# EAGLE design SensorBoard_Rev3-2 (EAGLE 4.16)
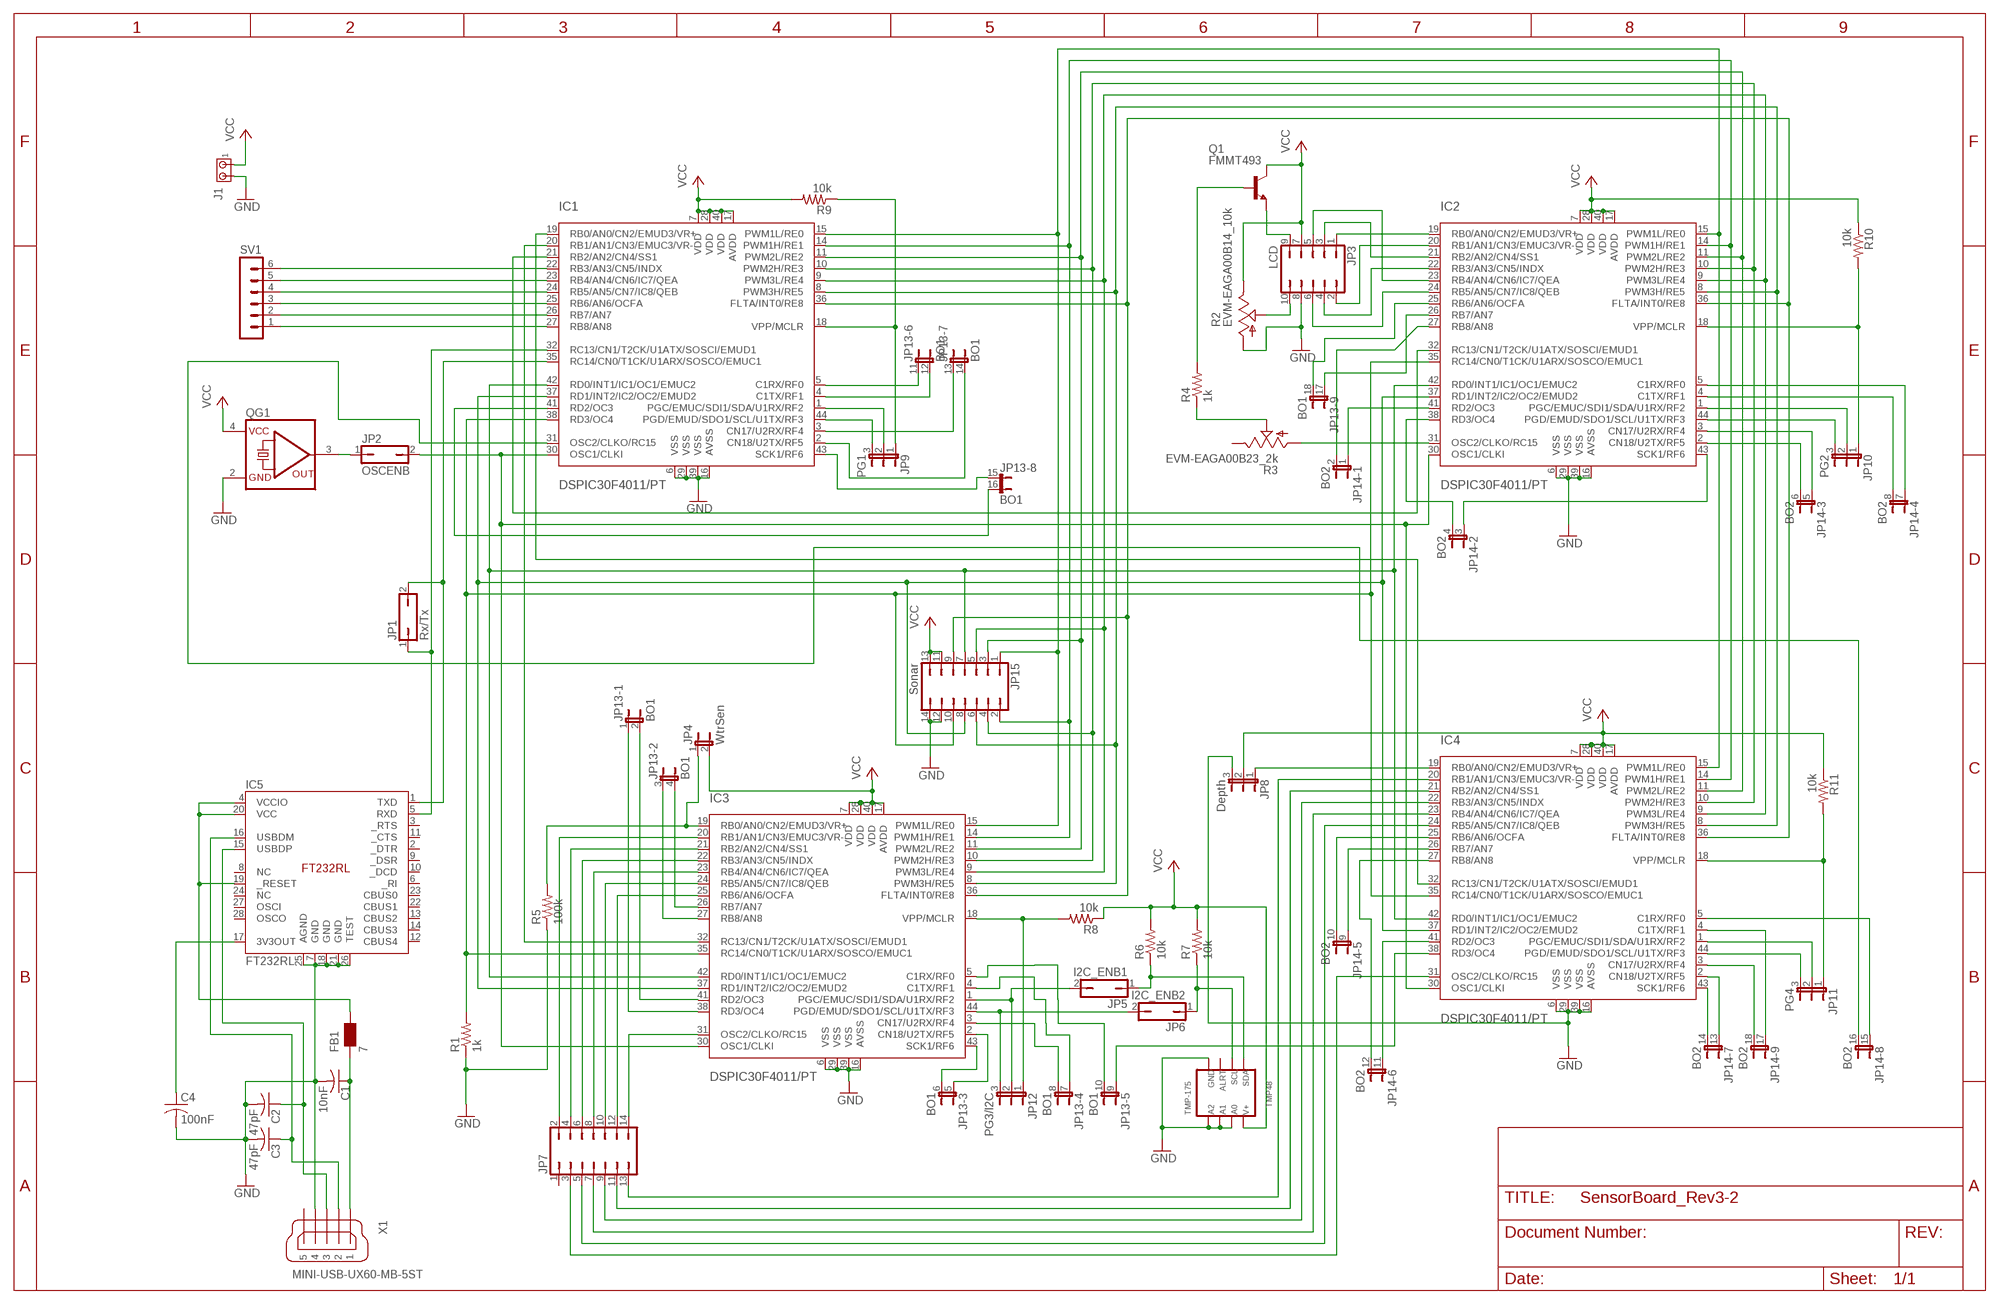
[diagram p0: schematic, sheet 1]

## Parts
C1  10nF  C-USC1206K  [C1206K]
C2  47pF  C-USC1206K  [C1206K]
C3  47pF  C-USC1206K  [C1206K]
C4  100nF  C-USC1206K  [C1206K]
FB1  7  WE-CBF_0805  [0805]
IC1  DSPIC30F4011/PT  [TQFP44]
IC2  DSPIC30F4011/PT  [TQFP44]
IC3  DSPIC30F4011/PT  [TQFP44]
IC4  DSPIC30F4011/PT  [TQFP44]
IC5  FT232RL  [SSOP-28]
J1  MTA02-156  [1X2MTA]
JP1  Rx/Tx  JP1Q  [JP1]
JP2  OSCENB  JP1Q  [JP1]
JP3  LCD  JP5Q  [JP5Q]
JP4  WtrSen  JP1E  [JP1]
JP5  I2C_ENB1  JP1Q  [JP1]
JP6  I2C_ENB2  JP1Q  [JP1]
JP7  JP7Q  [JP7Q]
JP8  Depth  JP2E  [JP2]
JP9  PG1  JP2E  [JP2]
JP10  PG2  JP2E  [JP2]
JP11  PG4  JP2E  [JP2]
JP12  PG3/I2C  JP2E  [JP2]
JP13  BO1  JP9QE  [JP9Q]
JP14  BO2  JP9QE  [JP9Q]
JP15  Sonar  JP7Q  [JP7Q]
Q1  FMMT493  -NPN-SOT23-EBC  [SOT23-EBC]
QG1  SG531  [DIL08-4]
R1  1k  R-US_R1206  [R1206]
R2  EVM-EAGA00B14_10k  TRIM_US-CT6  [CT6]
R3  EVM-EAGA00B23_2k  TRIM_US-CT6  [CT6]
R4  1k  R-US_R1206  [R1206]
R5  100k  R-US_R1206  [R1206]
R6  10k  R-US_R1206  [R1206]
R7  10k  R-US_R1206  [R1206]
R8  10k  R-US_R1206  [R1206]
R9  10k  R-US_R1206  [R1206]
R10  10k  R-US_R1206  [R1206]
R11  10k  R-US_R1206  [R1206]
SV1  MA06-1  [MA06-1]
TMP48  TMP-175  [SO-08]
X1  MINI-USB-UX60-MB-5ST  [UX60-MB-5ST]

## Nets
GND [4amps]: C1.2 C2.2 C3.2 C4.2 IC1.6(VSS) IC1.16(AVSS) IC1.29(VSS) IC1.39(VSS) IC2.6(VSS) IC2.16(AVSS) IC2.29(VSS) IC2.39(VSS) IC3.6(VSS) IC3.16(AVSS) IC3.29(VSS) IC3.39(VSS) IC4.6(VSS) IC4.16(AVSS) IC4.29(VSS) IC4.39(VSS) IC5.7(GND) IC5.18(GND) IC5.21(GND) IC5.25(AGND) IC5.26(TEST) J1.2 JP3.8 JP8.3 JP15.12 JP15.14 QG1.2(GND) R1.1 R2.A R5.1 TMP48.4 TMP48.5 TMP48.6 TMP48.7 X1.4
N$1: IC1.19(RB0/AN0/CN2/EMUD3/VR+) IC4.32(RC13/CN1/T2CK/U1ATX/SOSCI/EMUD1)
N$2: IC1.20(RB1/AN1/CN3/EMUC3/VR-) IC3.32(RC13/CN1/T2CK/U1ATX/SOSCI/EMUD1)
N$3: IC1.21(RB2/AN2/CN4/SS1) IC2.32(RC13/CN1/T2CK/U1ATX/SOSCI/EMUD1)
N$4: IC1.22(RB3/AN3/CN5/INDX) SV1.6
N$5: IC1.24(RB5/AN5/CN7/IC8/QEB) SV1.4
N$6: IC1.25(RB6/AN6/OCFA) SV1.3
N$7: IC1.26(RB7/AN7) SV1.2
N$8: IC1.27(RB8/AN8) SV1.1
N$9: IC1.30(OSC1/CLKI) IC2.30(OSC1/CLKI) IC3.30(OSC1/CLKI) IC4.30(OSC1/CLKI) JP2.2
N$10: C2.1 IC5.15(USBDP) X1.3
N$11: C1.1 FB1.1 X1.1
N$12: C3.1 IC5.16(USBDM) X1.2
N$13: C4.1 IC5.17(3V3OUT)
N$14: FB1.2 IC5.4(VCCIO) IC5.19(_RESET) IC5.20(VCC)
N$15: IC1.32(RC13/CN1/T2CK/U1ATX/SOSCI/EMUD1) IC5.5(RXD) JP1.1
N$16: IC1.35(RC14/CN0/T1CK/U1ARX/SOSCO/EMUC1) IC5.1(TXD) JP1.2
N$17: JP2.1 QG1.3(OUT)
N$18: IC1.23(RB4/AN4/CN6/IC7/QEA) SV1.5
N$19: IC1.15(PWM1L/RE0) IC2.15(PWM1L/RE0) IC3.15(PWM1L/RE0) IC4.15(PWM1L/RE0) JP15.1
N$20: IC1.14(PWM1H/RE1) IC2.14(PWM1H/RE1) IC3.14(PWM1H/RE1) IC4.14(PWM1H/RE1) JP15.2
N$21: IC1.11(PWM2L/RE2) IC2.11(PWM2L/RE2) IC3.11(PWM2L/RE2) IC4.11(PWM2L/RE2) JP15.3
N$22: IC1.10(PWM2H/RE3) IC2.10(PWM2H/RE3) IC3.10(PWM2H/RE3) IC4.10(PWM2H/RE3) JP15.4
N$23: IC1.9(PWM3L/RE4) IC2.9(PWM3L/RE4) IC3.9(PWM3L/RE4) IC4.9(PWM3L/RE4) JP15.5
N$24: IC1.8(PWM3H/RE5) IC2.8(PWM3H/RE5) IC3.8(PWM3H/RE5) IC4.8(PWM3H/RE5) JP15.6
N$25: IC1.42(RD0/INT1/IC1/OC1/EMUC2) IC2.42(RD0/INT1/IC1/OC1/EMUC2) IC3.42(RD0/INT1/IC1/OC1/EMUC2) IC4.42(RD0/INT1/IC1/OC1/EMUC2) JP15.7
N$26: IC1.37(RD1/INT2/IC2/OC2/EMUD2) IC2.37(RD1/INT2/IC2/OC2/EMUD2) IC3.37(RD1/INT2/IC2/OC2/EMUD2) IC4.37(RD1/INT2/IC2/OC2/EMUD2) JP15.8
N$27: IC1.38(RD3/OC4) IC2.35(RC14/CN0/T1CK/U1ARX/SOSCO/EMUC1) IC3.35(RC14/CN0/T1CK/U1ARX/SOSCO/EMUC1) IC4.35(RC14/CN0/T1CK/U1ARX/SOSCO/EMUC1) JP15.10 R1.2
N$28: IC1.36(FLTA/INT0/RE8) IC2.36(FLTA/INT0/RE8) IC3.36(FLTA/INT0/RE8) IC4.36(FLTA/INT0/RE8) JP15.9
N$29: IC2.19(RB0/AN0/CN2/EMUD3/VR+) JP3.1
N$30: IC2.20(RB1/AN1/CN3/EMUC3/VR-) JP3.2
N$31: IC2.21(RB2/AN2/CN4/SS1) JP3.3
N$32: IC2.22(RB3/AN3/CN5/INDX) JP3.4
N$33: IC2.23(RB4/AN4/CN6/IC7/QEA) JP3.5
N$34: IC2.24(RB5/AN5/CN7/IC8/QEB) JP3.6
N$35: JP3.10 R2.S
N$36: IC2.31(OSC2/CLKO/RC15) R3.A
N$37: R3.S R4.1
N$38: JP3.9 Q1.E
N$39: Q1.B R4.2
N$40: IC3.21(RB2/AN2/CN4/SS1) JP7.4
N$41: IC3.19(RB0/AN0/CN2/EMUD3/VR+) JP4.1 R5.2
N$42: IC3.22(RB3/AN3/CN5/INDX) JP7.6
N$43: JP6.1 R7.1 TMP48.2
N$44: JP5.1 R6.1 TMP48.1
N$45: IC3.1(PGC/EMUC/SDI1/SDA/U1RX/RF2) JP5.2 JP12.2
N$46: IC3.44(PGD/EMUD/SDO1/SCL/U1TX/RF3) JP6.2 JP12.3
N$47: IC3.23(RB4/AN4/CN6/IC7/QEA) JP7.8
N$48: IC3.24(RB5/AN5/CN7/IC8/QEB) JP7.10
N$49: IC3.25(RB6/AN6/OCFA) JP7.12
N$50: IC3.20(RB1/AN1/CN3/EMUC3/VR-) JP7.2
N$51: IC3.31(OSC2/CLKO/RC15) JP7.14
N$52: IC4.19(RB0/AN0/CN2/EMUD3/VR+) JP8.1
N$53: IC4.20(RB1/AN1/CN3/EMUC3/VR-) JP7.13
N$54: IC4.21(RB2/AN2/CN4/SS1) JP7.11
N$55: IC4.22(RB3/AN3/CN5/INDX) JP7.9
N$56: IC4.23(RB4/AN4/CN6/IC7/QEA) JP7.7
N$57: IC4.24(RB5/AN5/CN7/IC8/QEB) JP7.5
N$58: IC4.31(OSC2/CLKO/RC15) JP7.3
N$59: IC3.18(VPP/MCLR) JP12.1 R8.2
N$60: IC1.18(VPP/MCLR) JP9.1 R9.1
N$61: IC2.18(VPP/MCLR) JP10.1 R10.2
N$62: IC1.1(PGC/EMUC/SDI1/SDA/U1RX/RF2) JP9.2
N$63: IC1.44(PGD/EMUD/SDO1/SCL/U1TX/RF3) JP9.3
N$64: IC2.1(PGC/EMUC/SDI1/SDA/U1RX/RF2) JP10.2
N$65: IC2.44(PGD/EMUD/SDO1/SCL/U1TX/RF3) JP10.3
N$66: IC4.18(VPP/MCLR) JP11.1 R11.2
N$67: IC4.1(PGC/EMUC/SDI1/SDA/U1RX/RF2) JP11.2
N$68: IC4.44(PGD/EMUD/SDO1/SCL/U1TX/RF3) JP11.3
N$69: IC3.38(RD3/OC4) JP13.1
N$70: IC3.41(RD2/OC3) JP13.2
N$71: IC3.27(RB8/AN8) JP13.3
N$72: IC3.26(RB7/AN7) JP13.4
N$73: IC3.2(CN18/U2TX/RF5) JP13.5
N$74: IC3.43(SCK1/RF6) JP13.6
N$75: IC3.4(C1TX/RF1) JP13.7
N$76: IC3.3(CN17/U2RX/RF4) JP13.8
N$77: IC3.5(C1RX/RF0) JP13.10
N$78: IC1.43(SCK1/RF6) JP13.15
N$79: IC1.2(CN18/U2TX/RF5) JP13.14
N$80: IC1.3(CN17/U2RX/RF4) JP13.13
N$81: IC1.4(C1TX/RF1) JP13.12
N$82: IC1.5(C1RX/RF0) JP13.11
N$83: IC1.41(RD2/OC3) JP13.16
N$84: IC2.25(RB6/AN6/OCFA) JP13.18
N$85: IC2.26(RB7/AN7) JP13.17
N$86: IC2.27(RB8/AN8) JP14.2
N$87: IC2.41(RD2/OC3) JP14.1
N$88: IC2.38(RD3/OC4) JP14.4
N$89: IC2.43(SCK1/RF6) JP14.3
N$90: IC2.2(CN18/U2TX/RF5) JP14.6
N$91: IC2.3(CN17/U2RX/RF4) JP14.5
N$92: IC2.5(C1RX/RF0) JP14.7
N$93: IC2.4(C1TX/RF1) JP14.8
N$94: IC4.25(RB6/AN6/OCFA) JP14.10
N$95: IC4.26(RB7/AN7) JP14.9
N$96: IC4.27(RB8/AN8) JP14.12
N$97: IC4.41(RD2/OC3) JP14.11
N$98: IC4.43(SCK1/RF6) JP14.14
N$99: IC4.2(CN18/U2TX/RF5) JP14.13
N$100: IC4.3(CN17/U2RX/RF4) JP14.18
N$101: IC4.4(C1TX/RF1) JP14.17
N$102: IC4.5(C1RX/RF0) JP14.15
N$103: IC4.38(RD3/OC4) JP13.9
N$104: IC1.31(OSC2/CLKO/RC15) JP14.16
VCC [4amps]: IC1.7(VDD) IC1.17(AVDD) IC1.28(VDD) IC1.40(VDD) IC2.7(VDD) IC2.17(AVDD) IC2.28(VDD) IC2.40(VDD) IC3.7(VDD) IC3.17(AVDD) IC3.28(VDD) IC3.40(VDD) IC4.7(VDD) IC4.17(AVDD) IC4.28(VDD) IC4.40(VDD) J1.1 JP3.7 JP4.2 JP8.2 JP15.11 JP15.13 Q1.C QG1.4(VCC) R2.E R6.2 R7.2 R8.1 R9.2 R10.1 R11.1 TMP48.8
Unconnected: IC5.2(_DTR) IC5.3(_RTS) IC5.6(_RI) IC5.8(NC) IC5.9(_DSR) IC5.10(_DCD) IC5.11(_CTS) IC5.12(CBUS4) IC5.13(CBUS2) IC5.14(CBUS3) IC5.22(CBUS1) IC5.23(CBUS0) IC5.24(NC) IC5.27(OSCI) IC5.28(OSCO) JP7.1 R3.E TMP48.3 X1.5

## Library data of the parts
C1-C4 = rcl:C-US: CAPACITOR, American symbol
FB1 = wuerth-elektronik:WE-CBF: SMD EMI Suppression Ferrite Beads - excellent anti-EMI properties - low DCR - impedances till 3000 ohms - rated current up to 6 A
IC1-IC4 = microchip-dspic:DSPIC30F4011: dsPIC Motion Controller DSC
IC5 = ftdi4:FT232RL
J1 = con-amp:MTA02-156: AMP connector
JP1 JP2 JP5 JP6 = jumper:JP1Q: JUMPER
JP3 = jumper:JP5Q: JUMPER
JP4 = jumper:JP1E: JUMPER
JP7 JP15 = jumper:JP7Q: JUMPER
JP8-JP12 = jumper:JP2E: JUMPER
JP13 JP14 = jumper:JP9QE: JUMPER
Q1 = transistor:*-NPN-: NPN Transistror
QG1 = crystal:SG531: CRYSTAL RESONATOR
R1 R4-R11 = rcl:R-US_: RESISTOR, American symbol
R2 R3 = pot:TRIM_US-: POTENTIOMETER
SV1 = con-lstb:MA06-1: PIN HEADER
TMP48 = texas:TMP-175
X1 = con-hirose:MINI-USB-: MINI USB Connector Source: http://www.hirose.co.jp/cataloge_hp/e24000019.pdf

## Net classes
0 default: width 0.178 mm, drill 0.178 mm
1 2amps: width 0.178 mm, drill 0.178 mm
2 4amps: width 0.61 mm, drill 0.178 mm

## Board
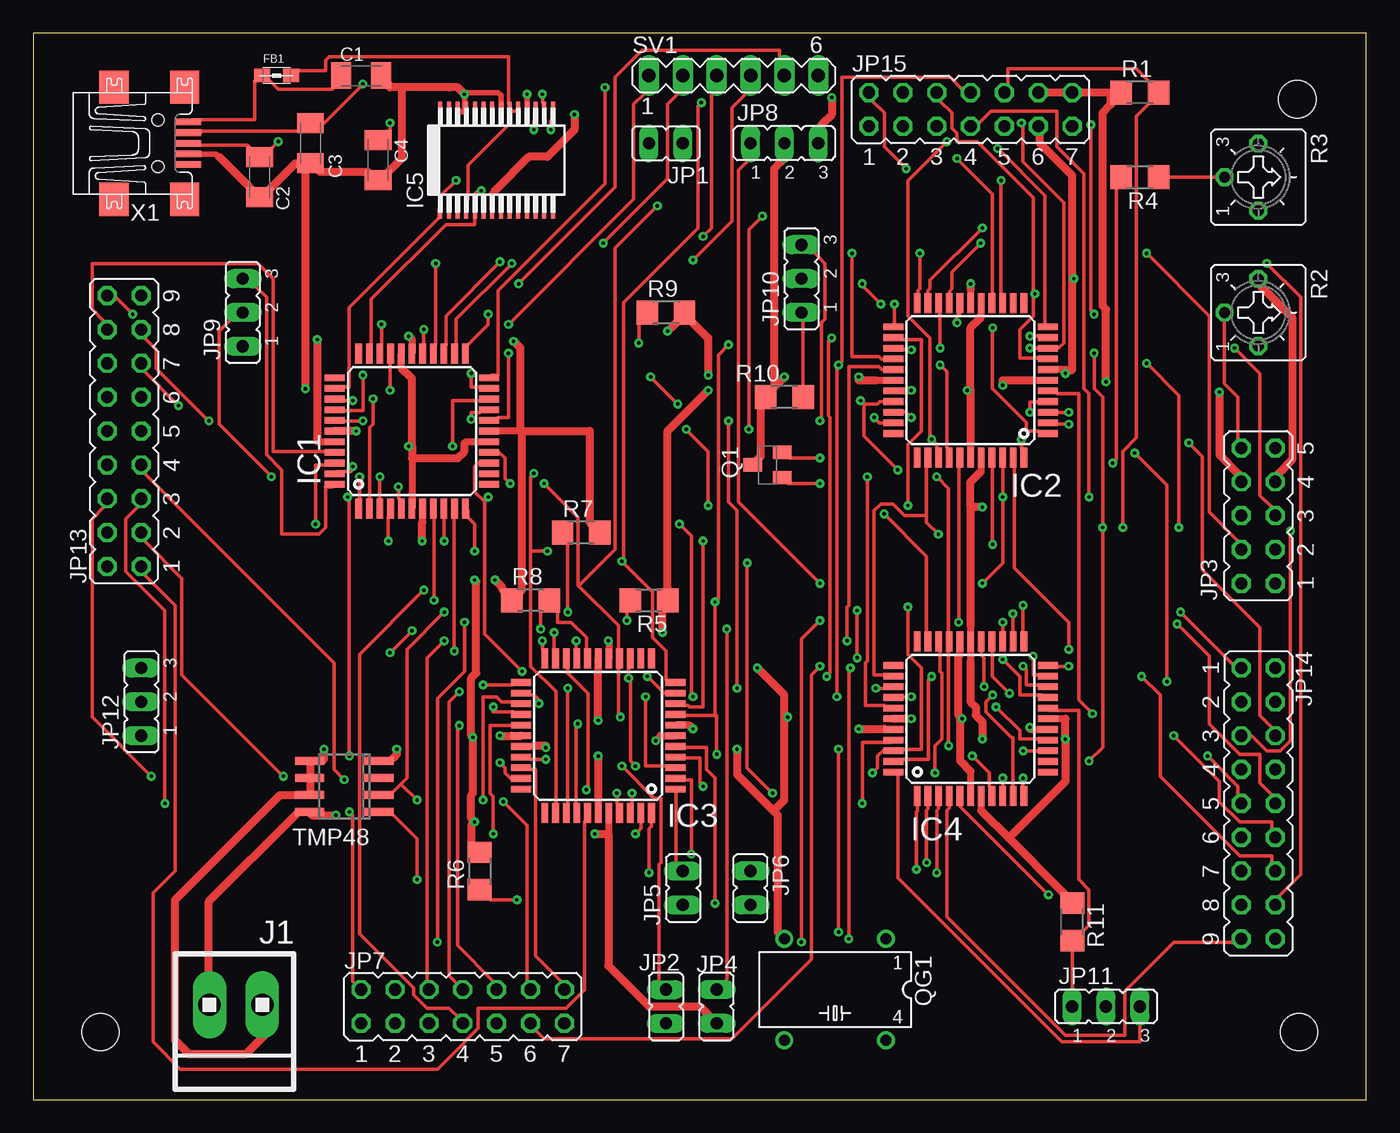
[diagram p1: board, top side]
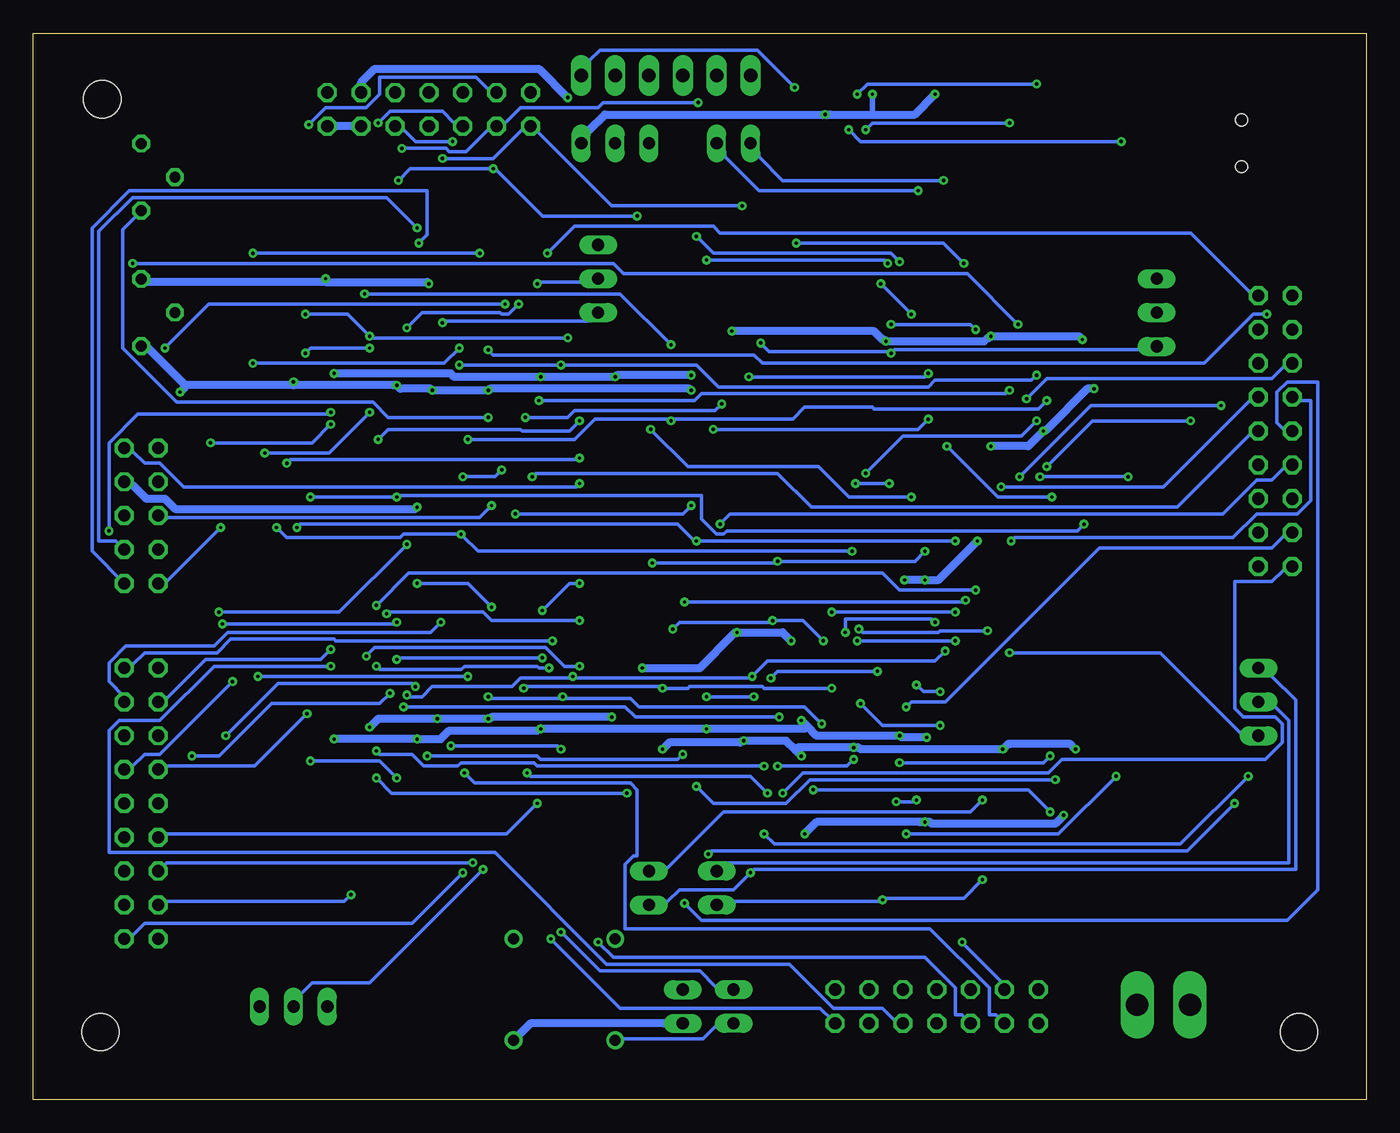
[diagram p2: board, bottom side, seen from below]

Size 100 x 80 mm. Coordinates in mm from the lower left corner, seen from the top.
Outline: 0,0 100,0 100,80 0,80 0,0
Copper layers (1*16): Top 0.1778mm / dielectric 0.7366mm / Bottom 0.1778mm
Design rules "default": minimum track width 10mil, minimum drill 10mil, track to track 8mil, track to pad 8mil, pad to pad 8mil, via to via 8mil, smd to smd 8mil, copper to edge 40mil, drill to drill 8mil, minimum pad ring 10mil, minimum via ring 8mil, stop-mask expansion 4mil, vias tented up to drill 0mil, thermal gap 10mil
Holes 2.8 mm at 5.04,5.08 94.96,5.08 94.83,75.05

### Footprints (pad centres in the part's own frame; a part is rotated, then mirrored left to right if it is on the bottom)
C1206K = smd 1.5 x 2: 1 -1.5,0; 2 1.5,0
0805 = smd 1.2 x 1: 1 -1.1,0; 2 1.1,0
TQFP44 = smd 1.5 x 0.5: 1 -5.8,4; 2 -5.8,3.2; 3 -5.8,2.4; 4 -5.8,1.6; 5 -5.8,0.8; 6 -5.8,0; 7 -5.8,-0.8; 8 -5.8,-1.6; 9 -5.8,-2.4; 10 -5.8,-3.2; 11 -5.8,-4; 23 5.8,-4; 24 5.8,-3.2; 25 5.8,-2.4; 26 5.8,-1.6; 27 5.8,-0.8; 28 5.8,0; 29 5.8,0.8; 30 5.8,1.6; 31 5.8,2.4; 32 5.8,3.2; 33 5.8,4 | smd 0.5 x 1.5: 12 -4,-5.8; 13 -3.2,-5.8; 14 -2.4,-5.8; 15 -1.6,-5.8; 16 -0.8,-5.8; 17 0,-5.8; 18 0.8,-5.8; 19 1.6,-5.8; 20 2.4,-5.8; 21 3.2,-5.8; 22 4,-5.8; 34 4,5.8; 35 3.2,5.8; 36 2.4,5.8; 37 1.6,5.8; 38 0.8,5.8; 39 0,5.8; 40 -0.8,5.8; 41 -1.6,5.8; 42 -2.4,5.8; 43 -3.2,5.8; 44 -4,5.8
SSOP-28 = smd 0.3 x 1.5: 1 -4.225,-3.625; 2 -3.575,-3.625; 3 -2.925,-3.625; 4 -2.275,-3.625; 5 -1.625,-3.625; 6 -0.975,-3.625; 7 -0.325,-3.625; 8 0.325,-3.625; 9 0.975,-3.625; 10 1.625,-3.625; 11 2.275,-3.625; 12 2.925,-3.625; 13 3.575,-3.625; 14 4.225,-3.625; 15 4.225,3.625; 16 3.575,3.625; 17 2.925,3.625; 18 2.275,3.625; 19 1.625,3.625; 20 0.975,3.625; 21 0.325,3.625; 22 -0.325,3.625; 23 -0.975,3.625; 24 -1.625,3.625; 25 -2.275,3.625; 26 -2.925,3.625; 27 -3.575,3.625; 28 -4.225,3.625
1X2MTA = drill 1.676 long: 1 1.981,0; 2 -1.981,0
JP1 = drill 0.914 long: 1 0,-1.27; 2 0,1.27
JP5Q = drill 0.914 octagon: 1 -5.08,-1.27; 2 -5.08,1.27; 3 -2.54,-1.27; 4 -2.54,1.27; 5 0,-1.27; 6 0,1.27; 7 2.54,-1.27; 8 2.54,1.27; 9 5.08,-1.27; 10 5.08,1.27
JP7Q = drill 0.914 octagon: 1 -7.62,-1.27; 2 -7.62,1.27; 3 -5.08,-1.27; 4 -5.08,1.27; 5 -2.54,-1.27; 6 -2.54,1.27; 7 0,-1.27; 8 0,1.27; 9 2.54,-1.27; 10 2.54,1.27; 11 5.08,-1.27; 12 5.08,1.27; 13 7.62,-1.27; 14 7.62,1.27
JP2 = drill 0.914 long: 1 -2.54,0; 2 0,0; 3 2.54,0
JP9Q = drill 0.914 octagon: 1 -10.16,-1.27; 2 -10.16,1.27; 3 -7.62,-1.27; 4 -7.62,1.27; 5 -5.08,-1.27; 6 -5.08,1.27; 7 -2.54,-1.27; 8 -2.54,1.27; 9 0,-1.27; 10 0,1.27; 11 2.54,-1.27; 12 2.54,1.27; 13 5.08,-1.27; 14 5.08,1.27; 15 7.62,-1.27; 16 7.62,1.27; 17 10.16,-1.27; 18 10.16,1.27
SOT23-EBC = smd 1 x 1.4: B 0.95,-1.1; C 0,1.1; E -0.95,-1.1
DIL08-4 = drill 0.813 round: 1 -3.81,-3.81; 2 3.81,-3.81; 3 3.81,3.81; 4 -3.81,3.81
R1206 = smd 1.6 x 1.8: 1 -1.4,0; 2 1.4,0
CT6 = drill 0.813 octagon: A 2.515,0; E -2.515,0; S 0,-2.54
MA06-1 = drill 1.016 long: 1 -6.35,0; 2 -3.81,0; 3 -1.27,0; 4 1.27,0; 5 3.81,0; 6 6.35,0
SO-08 = smd 0.6 x 2.2: 1 -1.905,-2.6; 2 -0.635,-2.6; 3 0.635,-2.6; 4 1.905,-2.6; 5 1.905,2.6; 6 0.635,2.6; 7 -0.635,2.6; 8 -1.905,2.6
UX60-MB-5ST = smd 2 x 0.5: 1 2.25,1.6; 2 2.25,0.8; 3 2.25,0; 4 2.25,-0.8; 5 2.25,-1.6 | smd 2.2 x 2.5: M1 -3.3,-4.2; M2 -3.3,4.2; M3 2,4.2; M4 2,-4.2 | hole 0.9: 0,-1.75; 0,1.75

### Placement (x,y rotation side)
C1  24.6,76.83 0 top
C2  16.98,69.21 270 top
C3  20.79,71.75 270 top
C4  25.87,70.48 270 top
FB1  18.25,76.83 0 top
IC1  28.41,50.16 90 top
IC2  70.32,53.97 180 top
IC3  42.38,27.3 180 top
IC4  70.32,28.57 90 top
IC5  34.76,70.48 0 top
J1  15.2,7.11 180 top
JP1  47.46,71.75 90 top
JP2  47.46,6.98 0 top
JP3  91.91,43.81 90 top
JP4  51.27,6.98 180 top
JP5  48.73,15.87 0 top
JP6  53.81,15.87 180 top
JP7  32.22,6.98 0 top
JP8  56.35,71.75 0 top
JP9  15.71,59.05 90 top
JP10  57.62,61.59 90 top
JP11  80.48,6.98 0 top
JP12  8.09,29.84 90 top
JP13  6.82,50.16 90 top
JP14  91.91,22.22 270 top
JP15  70.32,74.29 0 top
Q1  55.08,47.62 90 top
QG1  60.16,8.25 180 top
R1  83.02,75.56 0 top
R2  91.91,59.05 270 top
R3  91.91,69.21 270 top
R4  83.02,69.21 180 top
R5  46.19,37.46 180 top
R6  33.49,17.14 90 top
R7  41.11,42.54 0 top
R8  37.3,37.46 0 top
R9  47.46,59.05 0 top
R10  56.35,52.7 0 top
R11  77.94,13.33 270 top
SV1  52.54,76.83 0 top
TMP48  23.33,23.49 90 top
X1  9.36,71.75 0 top

### Tracks (layer width: path | path; a pad name or v marks a point on that pad's centre or on a via)
GND  (via drill 0.25)
  Top 0.254: 43.27,33.02 IC3.16
  Top 0.406: IC5.21 35.09,75.36 34.89,75.56 32.47,75.56 v32.35,75.43 32.35,74.16 | 32.35,74.16 32.41,74.1 | 32.41,74.1 IC5.25 32.41,74.1 | 32.35,74.16 32.41,74.1 | IC5.26 32.29,74.1 32.35,74.16 | IC5.7 34.44,68 34.63,68.19 | IC5.18 37.03,75.42 v37.05,75.43 | X1.4 13.64,70.95 13.72,70.95 13.93,70.73
  Top 0.508: 27.61,54.9 27.65,54.86 27.61,54.9 | 70.32,49.27 70.32,49.14 IC2.39 | IC2.16 71.12,58.83 71.08,58.8 | 28.41,48.13 IC1.6 | 47.08,27.3 IC3.6 | 42.38,22.47 IC3.39 | IC3.29 37.52,26.5 37.55,26.54 | IC3.16 43.18,34.37 v43.14,34.41 | 70.32,24.63 IC4.6 | 27.61,54.9 IC1.29 | IC4.29 69.52,33.36 69.43,33.27 69.43,33.14 69.39,33.14 | 74.89,53.97 75.02,53.97 IC2.6 | IC2.29 65.71,53.17 65.75,53.21 | v74.77,27.93 74.89,27.93 75.02,27.81 75.06,27.77 IC4.16 | IC1.16 32.51,49.36 32.44,49.36 32.35,49.27 32.35,49.14
  Top 0.61: v65.88,28.57 65.24,28.57 IC4.39 | 70.32,24.63 69.56,25.39 69.52,25.43 69.52,28.57 | 75.02,27.81 74.77,27.81 v74.77,27.93 | v47.21,35.05 47.21,36.57 47.21,37.08 R5.1 | v42.38,25.78 42.38,22.47 | v46.7,26.92 47.08,27.3 | 37.55,26.54 38.44,26.54 v38.44,26.41 | v27.27,26.28 27.27,25.9 27.01,25.65 26.76,25.39 26,25.39 TMP48.4 | QG1.2 55.84,12.57 55.84,21.33 55.52,21.65 | 55.52,21.65 52.79,24.38 v52.79,26.28 | v54.32,32.38 56.35,30.35 56.35,28.7 | 56.35,28.7 56.35,22.47 55.71,21.84 55.52,21.65 | 56.35,28.7 v56.6,28.7 | v21.81,26.28 21.81,25.65 21.81,25.52 21.68,25.39 20.79,25.39 | 28.41,49.02 28.41,54.1 27.65,54.86 | 28.41,49.02 28.41,48.13 28.66,48.13 31.84,48.13 32.35,48.64 32.35,49.14 | v24.22,50.16 23.33,50.16 IC1.39 | v28.16,49.02 28.41,49.02 | 27.65,75.94 26.76,75.94 26.76,76.07 26.12,76.7 26.1,76.73 C1.2 | 27.65,75.94 31.2,75.94 31.84,75.94 v32.35,75.43 | 13.93,70.73 15.58,69.08 16.98,67.69 | 27.65,75.94 27.65,75.69 27.65,70.61 26.76,69.72 26.02,68.98 C4.2 25.72,68.98 25.11,69.59 24.98,69.59 21.68,69.59 21.55,69.59 20.92,70.23 20.89,70.25 C3.2 | v20.41,53.34 20.41,69.59 20.41,69.84 20.79,70.23 C3.2 | 80.86,75.56 78.58,75.56 JP15.14 77.3,75.56 76.03,75.56 JP15.12 | 80.86,75.56 R1.1 | v59.91,75.18 59.91,73.91 59.14,73.15 59.14,72 JP8.3 | 70.32,53.21 70.32,57.91 71.08,58.67 71.08,58.8 | 70.32,53.21 70.32,49.27 | v65.88,53.21 65.75,53.21 | v70.07,53.21 70.32,53.21 | 74.89,53.97 72.73,53.97 v72.73,53.59 | v88.99,53.08 88.99,48.38 90.39,46.98 90.51,46.86 90.64,46.73 JP3.8 | v80.48,53.84 80.48,59.3 80.23,59.56 80.23,74.04 80.86,74.67 80.86,75.56 | v50.63,53.21 47.59,50.16 47.59,38.35 R5.1
  Top 0.61: 20.79,24.12 TMP48.6 | 20.79,24.12 20.79,23.11 20.79,22.86 TMP48.7 18.5,22.86 10.63,14.98 10.63,4.44 11.65,3.42 15.96,3.42 17.36,4.82 17.36,7.11 J1.2 | 20.79,25.39 TMP48.5 | 20.79,24.12 20.79,25.39 | 16.98,67.81 16.85,67.81 | 16.98,67.81 17.23,67.81 17.87,68.45 19.65,70.23 20.66,70.23 20.69,70.25 C3.2 | C2.2 16.98,67.69 | 16.98,67.81 C2.2 | C2.2 16.98,67.69 | R5.1 | 34.63,68.19 37.17,70.73 38.57,70.73 40.6,72.77 v40.6,73.91 | C2.2 16.98,67.69 | 69.52,28.57 69.52,28.73 | 69.39,33.18 69.39,33.14 69.39,28.86 | 69.52,28.57 69.56,28.57 v69.69,28.57 | v69.69,28.57 69.39,28.86 | v69.69,28.57 69.39,28.86
  Bottom 0.406: 37.05,73.91 v37.05,75.43
  Bottom 0.61: v74.77,27.93 74.13,28.57 v69.69,28.57 v65.88,28.57 65.75,28.57 65.62,28.7 v56.6,28.7 | v43.14,34.41 43.78,35.05 v47.21,35.05 47.33,35.05 47.46,34.92 50,32.38 v54.32,32.38 | 42.82,26.22 43.52,26.92 v46.7,26.92 46.82,26.92 46.95,26.79 52.29,26.79 v52.79,26.28 | 42.82,26.22 v42.38,25.78 | 42.82,26.22 42.63,26.41 v38.44,26.41 38.19,26.41 38.06,26.41 37.94,26.28 v27.27,26.28 26.89,26.66 26.76,26.66 22.19,26.66 v21.81,26.28 | v28.16,49.02 25.36,49.02 v24.22,50.16 24.09,50.16 23.96,50.29 20.92,53.34 v20.41,53.34 | v59.91,75.18 62.06,77.34 74.38,77.34 75.4,76.32 75.4,75.81 JP15.12 | 88.61,53.59 91.28,56.26 91.66,56.64 91.76,56.54 R2.A | 80.48,53.59 72.99,53.59 v72.73,53.59 72.48,53.34 70.32,53.34 70.19,53.34 v70.07,53.21 v65.88,53.21 65.75,53.34 65.62,53.34 50.76,53.34 v50.63,53.21 | 80.48,53.59 88.61,53.59 | 88.73,53.34 v88.99,53.08 88.73,53.34 | 80.48,53.59 v80.48,53.84 | v32.35,75.43 33.87,73.91 37.05,73.91 40.22,73.91 | v40.6,73.91 57.11,73.91 58.25,72.77 58.89,72.13 JP8.3 | v40.6,73.91 40.22,73.91 | v40.6,73.91 40.22,73.91 | 88.61,53.59 88.61,53.46 88.73,53.34
N$1  (via drill 0.25)
  Top 0.254: v32.85,51.05 32.85,51.56 33.49,51.56 33.62,51.68 34.12,51.68 IC1.19 | v48.98,50.29 50.63,48.64 v50.63,44.57 | v63.84,43.94 67.02,40.76 67.02,35.05 67.12,34.95 IC4.32
  Bottom 0.254: v32.85,51.05 33.62,50.29 v48.98,50.29 | v50.63,44.57 51.27,43.94 v63.84,43.94
N$2  (via drill 0.25)
  Top 0.254: v31.46,49.02 31.46,52.45 33.49,52.45 33.6,52.56 IC1.20 | v23.58,45.21 23.71,45.08 v23.71,25.78 | v35.01,25.27 35.39,24.89 35.39,24.51 35.9,24 36.54,24 36.58,24.04 IC3.32
  Bottom 0.254: v31.46,49.02 27.65,45.21 v23.58,45.21 | v23.71,25.78 24.22,25.27 v35.01,25.27
N$3  (via drill 0.25)
  Top 0.254: v32.85,54.48 32.85,53.46 33.49,53.46 33.59,53.36 IC1.21 | v46.32,54.22 v48.35,52.19 | IC2.32 63.49,50.77 v63.08,51.18
  Bottom 0.254: v32.85,54.48 33.11,54.22 v46.32,54.22 | v48.35,52.19 48.86,51.68 59.4,51.68 59.91,51.18 v63.08,51.18
N$4  (via drill 0.25)
  Top 0.254: v42.89,75.94 42.89,68.7 34.89,60.7 34.89,54.35 34.38,54.35 34.25,54.22 34.21,54.18 IC1.22
  Bottom 0.254: v42.89,75.94 45.68,78.73 57.49,78.73 58.25,77.97 58.25,77.59 58.89,76.96 SV1.6
N$5  (via drill 0.25)
  Top 0.254: v35.9,62.73 31.71,58.54 31.71,56.64 31.61,56.54 IC1.24 | v49.49,62.99 52.41,65.91 52.41,74.42 53.43,75.43 53.81,75.81 SV1.4
  Bottom 0.254: v35.9,62.73 36.16,62.99 v49.49,62.99
N$6  (via drill 0.25)
  Top 0.254: v35.01,62.86 30.95,58.8 30.95,56.64 30.81,56.5 IC1.25 | v50.25,64.77 50.89,65.4 50.89,75.43 51.27,75.81 SV1.3
  Bottom 0.254: v35.01,62.86 35.65,63.5 48.98,63.5 v50.25,64.77
N$7  (via drill 0.25)
  Top 0.254: v30.19,62.73 30.19,56.64 30.01,56.46 IC1.26 | v42.76,64.26 47.59,69.08 47.59,74.67 48.35,75.43 48.73,75.81 SV1.2
  Bottom 0.254: v30.19,62.73 31.71,64.26 v42.76,64.26
N$8  (via drill 0.25)
  Top 0.254: v29.3,57.78 29.3,56.64 29.21,56.55 IC1.27 | v35.65,58.16 45.05,67.56 45.05,74.67 45.81,75.43 46.19,75.81 SV1.1
  Bottom 0.254: v29.3,57.78 29.68,58.16 v35.65,58.16
N$9  (via drill 0.25)
  Top 0.254: v38.44,25.52 37.3,25.52 37.17,25.65 36.66,25.65 36.61,25.7 IC3.30 | v44.16,25.01 46.57,22.6 47.08,22.6 47.08,17.77 46.95,17.65 46.95,8.89 46.95,8.76 JP2.2 | 62.32,52.19 62.32,49.78 v64.86,47.24 | v67.78,46.73 68.67,45.84 68.67,35.05 68.72,35 IC4.30 68.72,33.7 68.67,33.65 v68.67,26.54 | v26.76,53.21 26.76,55.24 26.81,55.29 IC1.30 | 62.32,52.19 v62.06,52.45 62.32,52.19 | v60.41,12.57 v60.41,26.28 | IC2.30 63.51,52.37 63.34,52.19 62.32,52.19
  Bottom 0.254: v38.44,25.52 38.95,25.01 v44.16,25.01 | v64.86,47.24 65.37,46.73 v67.78,46.73 | v26.76,53.21 27.01,52.95 49.87,52.95 50.38,52.45 v62.06,52.45 | v60.41,12.57 57.49,9.65 50,9.65 48.86,8.5 47.71,8.5 JP2.2 | v60.41,26.28 60.67,26.54 v68.67,26.54
N$10  (via drill 0.25)
  Top 0.254: v38.82,72.77 38.82,73.4 38.95,73.4 38.98,73.44 IC5.15 | v18.38,71.88 17.87,71.37 17.11,70.61 17,70.71 C2.1 16.98,70.73 16.85,70.86 16.09,71.62 12.54,71.62 12.41,71.75 X1.3
  Bottom 0.254: v38.82,72.77 37.94,71.88 v18.38,71.88
N$11
  Top 0.254: C1.1 23.08,76.83 22.44,76.19 22.44,75.94 22.44,75.81 18.38,75.81 17.74,76.45 17.36,76.83 FB1.1 17.11,76.83 16.73,76.45 16.6,76.45 16.6,73.53 12.54,73.53 11.9,73.53 11.77,73.4 11.72,73.35 X1.1
N$12  (via drill 0.25)
  Top 0.254: v38.19,75.43 38.19,74.8 38.34,74.65 IC5.16 | 21.81,73.27 21.68,73.15 | 21.81,73.27 v24.73,76.19 | 12.66,72.64 12.54,72.64 | 12.66,72.64 19.9,72.64 20.15,72.64 20.66,73.15 20.77,73.25 C3.1 21.78,73.25 21.81,73.27 | X1.2 12.57,72.55 12.66,72.64
  Bottom 0.254: v38.19,75.43 37.43,76.19 v24.73,76.19
N$13  (via drill 0.25)
  Top 0.254: v37.55,72.77 37.55,73.4 37.69,73.53 IC5.17 | v26.76,73.27 26.76,72.64 26.5,72.64 25.87,72 C4.1
  Bottom 0.254: v37.55,72.77 37.05,73.27 v26.76,73.27
N$14
  Top 0.254: 35.78,74.16 36.28,74.16 36.41,74.16 36.38,74.14 IC5.19 | IC5.4 32.48,66.81 32.47,66.8 32.47,67.43 32.6,67.56 32.6,70.1 35.65,73.15 35.65,73.4 35.78,73.53 35.78,74.16 | 35.78,74.16 35.73,74.12 | 35.73,74.12 IC5.20 35.73,74.12 | 35.78,74.16 35.78,74.67 35.65,74.8 35.65,78.23 22.19,78.23 21.93,77.97 21.93,77.21 19.9,77.21 19.65,77.21 19.27,76.83 FB1.2 | 35.78,74.16 35.73,74.12
N$15  (via drill 0.25)
  Top 0.254: IC1.32 25.21,56.48 25.36,56.64 25.36,60.07 30.95,65.65 33.11,65.65 33.11,66.16 33.11,66.8 | 33.11,66.8 33.13,66.82 | 33.13,66.82 IC5.5 33.13,66.82 | v33.62,68.19 33.36,68.19 33.11,67.94 33.11,66.8 | 33.11,66.8 33.13,66.82
  Bottom 0.254: v33.62,68.19 45.55,68.19 48.09,70.73 48.09,71.11 JP1.1
N$16  (via drill 0.25)
  Top 0.254: v31.71,68.96 30.57,67.81 30.57,67.56 30.57,66.92 | 30.57,66.92 30.54,66.89 | 30.54,66.89 IC5.1 30.54,66.89 | 30.57,66.92 30.44,66.8 30.44,66.16 23.71,59.43 23.71,53.46 23.33,53.46 22.7,53.46 22.57,53.34 22.59,53.36 IC1.35 | 30.57,66.92 30.54,66.89
  Bottom 0.254: v31.71,68.96 43.78,68.96 45.55,70.73 45.55,70.99 46.32,71.75 JP1.2
N$17
  Bottom 0.254: QG1.3 56.22,4.57 55.71,4.57 49.75,4.57 48.86,5.46 47.84,5.46 47.59,5.71 JP2.1
N$18  (via drill 0.25)
  Top 0.254: v34.12,58.92 34.12,58.16 32.6,56.64 32.41,56.45 IC1.23 | v36.41,61.21 43.65,68.45 43.65,76.7 45.68,78.73 55.97,78.73 55.97,78.23 55.97,77.08 56.35,76.7 SV1.5
  Bottom 0.254: v34.12,58.92 v36.41,61.21
N$19  (via drill 0.25)
  Top 0.254: v69.3,70.61 71.97,67.94 71.97,60.45 71.97,59.81 IC2.15 | 40.92,38.54 40.86,38.6 40.86,43.68 v38.32,46.22 | 40.92,38.54 43.9,35.55 43.9,33.78 43.9,33.4 44.03,33.27 43.98,33.22 IC3.15 43.98,33.07 44.03,33.02 43.9,32.89 43.9,32.38 43.9,28.82 v44.03,28.7 | v35.78,46.22 35.39,46.6 35.39,48.13 34.89,48.64 34.25,48.64 34.21,48.59 IC1.15 | v72.22,29.46 74,27.68 74,27.05 75.4,27.05 75.91,27.05 76.03,26.92 76.09,26.97 IC4.15 | v46.82,67.05 43.65,63.88 43.65,41.27 40.98,38.6 40.92,38.54
  Bottom 0.254: v69.3,70.61 65.49,70.61 63.34,72.77 63.08,73.02 JP15.1 62.32,72.64 62.19,72.64 56.6,67.05 v46.82,67.05 | v38.32,46.22 v35.78,46.22 | v72.22,29.46 55.59,29.46 54.83,28.7 44.28,28.7 v44.03,28.7
N$20  (via drill 0.25)
  Top 0.254: v72.61,68.96 72.61,60.45 72.61,60.07 72.73,59.94 72.72,59.93 IC2.14 | v65.49,69.84 63.84,71.5 63.84,74.04 62.95,74.92 62.95,75.31 JP15.2 | v36.66,32.13 33.87,34.92 33.87,44.83 33.81,44.89 | 33.81,44.89 33.11,45.59 33.11,47.49 33.36,47.75 33.38,47.76 IC1.14 | v74.26,26.16 75.4,26.16 76.03,26.16 76.05,26.17 IC4.14 | v45.17,25.01 44.79,25.39 44.79,31.49 v44.67,31.62 44.67,32.38 44.67,32.51 44.78,32.62 IC3.14 | v54.7,66.29 53.68,65.27 v53.68,50.29 | v34.12,45.21 33.87,44.95 33.81,44.89
  Bottom 0.254: v72.61,68.96 71.72,69.84 v65.49,69.84 65.37,69.84 65.24,69.72 61.81,66.29 v54.7,66.29 | v44.67,31.62 44.16,32.13 v36.66,32.13 | v74.26,26.16 74,25.9 71.59,25.9 70.7,25.01 68.16,25.01 67.91,25.27 62.45,25.27 62.19,25.01 v45.17,25.01 | v53.68,50.29 50.89,47.49 41.11,47.49 38.82,45.21 v34.12,45.21
N$21  (via drill 0.25)
  Top 0.254: v72.35,71.37 75.91,67.81 75.91,58.16 76.16,57.91 76.12,57.95 IC2.11 | v33.11,41.14 33.11,43.18 32.6,43.68 32.6,44.19 32.47,44.32 32.43,44.36 IC1.11 | v74.26,24.12 74.26,23.49 74.26,22.86 74.38,22.73 74.34,22.77 IC4.11 | v55.46,22.98 53.56,24.89 v53.56,40.25 | v50.13,74.8 49.87,74.54 49.87,65.4 44.28,59.81 44.28,40.64 44.16,40.51 v44.16,40.38 46.44,38.1 46.44,34.67 47.46,33.65 47.46,31.49 47.65,31.3 IC3.11
  Bottom 0.254: v72.35,71.37 69.05,71.37 68.8,71.11 67.53,71.11 65.88,72.77 65.49,72.77 JP15.3 64.99,73.27 64.61,73.27 63.46,74.42 57.62,74.42 57.24,74.8 v50.13,74.8 | v33.11,41.14 33.87,40.38 v44.16,40.38 44.28,40.38 44.41,40.25 v53.56,40.25 | v74.26,24.12 73.11,22.98 v55.46,22.98
N$22  (via drill 0.25)
  Top 0.254: v74.77,57.27 75.4,57.27 75.91,57.27 76.03,57.15 76.06,57.17 IC2.10 | v79.59,58.92 79.34,59.18 v79.34,73.15 | v31.58,33.65 31.58,43.68 31.58,44.32 31.61,44.34 IC1.10 | v46.06,31.74 47.21,30.6 | 47.21,30.6 47.33,30.47 | v71.97,30.35 71.46,29.84 71.46,29.08 73.37,27.17 73.5,27.17 73.5,23.49 73.52,23.46 IC4.10 | v59.91,57.15 59.65,56.89 59.65,51.3 59.78,51.18 59.78,32 v59.52,31.74 | IC3.10 47.31,30.5 47.21,30.6
  Bottom 0.254: v79.59,58.92 76.42,58.92 v74.77,57.27 74.64,57.27 74.51,57.15 v59.91,57.15 | v79.34,73.15 78.07,74.42 75.02,74.42 74,75.43 74,76.7 66.76,76.7 65.88,75.81 65.49,75.81 JP15.4 | v31.58,33.65 32.35,32.89 44.92,32.89 v46.06,31.74 46.19,31.62 46.32,31.62 59.52,31.62 | v71.97,30.35 71.84,30.22 70.83,30.22 70.07,30.98 69.69,30.98 64.1,30.98 63.46,31.62 59.52,31.62 | 59.52,31.62 v59.52,31.74
N$23  (via drill 0.25)
  Top 0.254: v50.25,41.91 50.25,29.46 49.24,29.46 49.11,29.59 48.86,29.59 48.35,29.59 48.22,29.71 48.21,29.7 IC3.9 | v30.82,41.91 30.82,43.68 30.82,44.32 30.81,44.33 IC1.9 | v72.73,24.12 72.73,23.49 72.72,23.48 IC4.9 | v79.21,25.39 80.23,26.41 v80.23,42.92 80.23,52.7 79.59,53.34 v79.59,56 | v74.77,56.38 75.4,56.38 76.03,56.38 | v74.13,73.27 74.26,73.15 74.26,70.35 77.3,67.3 77.3,56.76 76.92,56.38 76.03,56.38 | 76.03,56.38 76.05,56.37 | 76.05,56.37 IC2.9 76.05,56.37 | 76.03,56.38 76.05,56.37
  Bottom 0.254: v30.82,41.91 v50.25,41.91 50.38,41.91 50.51,42.03 51.65,43.18 79.97,43.18 v80.23,42.92 | v72.73,24.12 74,25.39 v79.21,25.39 | v79.59,56 79.21,56.38 v74.77,56.38 | v74.13,73.27 73.24,74.16 69.3,74.16 68.41,73.27 68.03,73.27 JP15.5
N$24  (via drill 0.25)
  Top 0.254: 75.02,60.45 75.02,67.69 70.83,71.88 69.3,71.88 69.3,72.51 68.92,72.89 68.92,74.04 68.03,74.92 68.03,75.31 JP15.6 | 75.02,60.45 75.02,58.8 74,57.78 74,55.62 75.4,55.62 75.91,55.62 76.03,55.49 IC2.8 | 51.14,28.82 51.27,28.82 v51.27,25.9 | 51.14,28.82 48.86,28.82 48.22,28.82 48.09,28.95 48.15,28.9 IC3.8 | v70.45,25.78 71.72,24.51 71.72,23.49 71.92,23.29 IC4.8 | v30.06,37.46 30.06,43.68 30.06,44.19 30.01,44.24 IC1.8 | 51.14,28.82 v51.14,37.33 51.4,37.59 51.4,55.88 v52.16,56.64 | v75.15,60.45 75.02,60.45
  Bottom 0.254: v51.27,25.9 51.65,25.52 61.94,25.52 62.19,25.78 v70.45,25.78 | v30.06,37.46 30.19,37.33 v51.14,37.33 | v75.15,60.45 55.97,60.45 v52.16,56.64
N$25  (via drill 0.25)
  Top 0.254: v44.92,22.98 44.92,22.22 44.78,22.08 IC3.42 | v62.95,24.51 63.34,24.89 63.34,25.78 63.84,26.28 64.35,26.28 64.48,26.16 64.49,26.17 IC4.42 65.13,26.17 65.24,26.28 66.64,26.28 66.64,32.38 65.62,33.4 v65.62,36.95 | v21.17,43.18 21.17,47.62 21.93,47.62 22.57,47.62 22.7,47.75 22.68,47.76 IC1.42 | v79.21,45.21 79.21,52.95 78.83,53.34 78.83,69.46 76.8,71.5 76.8,74.16 71.84,74.16 70.95,73.27 70.7,73.02 JP15.7 | v71.21,38.73 72.73,40.25 72.73,44.95 v72.73,45.21 72.73,47.49 72.72,47.51 IC2.42
  Bottom 0.254: v44.92,22.98 46.19,24.25 62.7,24.25 v62.95,24.51 | v21.17,43.18 21.68,42.67 47.97,42.67 48.22,42.41 48.73,42.41 49.87,43.56 49.87,45.33 72.61,45.33 v72.73,45.21 72.99,45.21 v79.21,45.21 | v65.62,36.95 67.4,38.73 v71.21,38.73
N$26  (via drill 0.25)
  Top 0.254: v40.86,28.19 40.73,28.06 40.73,22.22 40.73,21.58 40.78,21.53 IC3.37 | v65.88,30.22 65.24,30.22 64.48,30.22 IC4.37 | v24.73,54.35 24.73,51.68 23.33,51.68 22.82,51.68 22.7,51.81 22.64,51.76 IC1.37 | v68.03,55.11 68.54,54.61 68.54,48.89 68.72,48.71 IC2.37 | v60.29,30.22 60.29,54.86 60.41,54.99 v60.41,55.11 60.67,55.37 60.67,76.7 68.8,76.7 69.69,75.81 70.07,75.81 JP15.8
  Bottom 0.254: v40.86,28.19 42.13,29.46 54.57,29.46 55.21,30.09 60.29,30.09 | 60.29,30.09 65.75,30.09 v65.88,30.22 | v24.73,54.35 25.11,53.97 32.35,53.97 32.85,53.46 48.6,53.46 50.25,55.11 v60.41,55.11 v68.03,55.11 | 60.29,30.09 v60.29,30.22
N$27  (via drill 0.25)
  Top 0.254: 37.3,41.14 37.3,46.73 v37.55,46.98 | 37.3,41.14 37.3,32.51 39.2,30.6 39.2,22.22 39.2,21.58 39.18,21.56 IC3.35 | v24.73,50.92 23.33,50.92 22.7,50.92 22.66,50.96 IC1.38 | 67.02,43.81 65.37,43.81 64.86,44.32 64.48,44.7 63.59,44.7 63.08,44.19 63.08,31.87 63.84,31.87 63.95,31.77 IC4.35 | 67.02,43.81 67.02,47.49 67.02,48 67.14,48.13 67.12,48.15 IC2.35 | v81.75,42.92 81.75,48.64 82.77,49.65 82.77,73.78 83.66,74.67 84.42,75.43 84.42,75.44 R1.2 84.42,75.69 83.66,76.45 82.77,77.34 73.11,77.34 73.11,76.19 73.11,75.81 JP15.10 | v67.91,42.41 67.02,43.3 67.02,43.81 | 37.3,41.14 v38.57,41.14
  Bottom 0.254: v37.55,46.98 34.76,49.78 25.87,49.78 v24.73,50.92 | v81.75,42.92 80.99,42.16 72.48,42.16 72.22,42.41 v67.91,42.41 67.78,42.29 66.64,41.14 v38.57,41.14
N$28  (via drill 0.25)
  Top 0.254: v40.09,30.86 40.09,22.22 40.09,21.84 39.97,21.71 39.98,21.7 IC3.36 | v63.21,30.86 63.84,30.86 63.96,30.97 IC4.36 | v23.96,52.45 23.33,52.45 22.82,52.45 22.7,52.57 22.68,52.56 IC1.36 | v68.54,71.88 65.62,68.96 65.62,58.8 67.27,57.15 67.27,49.78 67.27,49.65 v67.4,49.53 67.78,49.14 67.78,48.89 67.78,48.26 67.91,48.13 67.92,48.14 IC2.36 | v52.79,30.86 52.79,44.19 52.16,44.83 v52.16,50.92
  Bottom 0.254: v40.09,30.86 45.17,30.86 45.3,30.98 50.76,30.98 50.89,30.86 v52.79,30.86 52.92,30.98 63.08,30.98 v63.21,30.86 | v23.96,52.45 24.6,51.81 36.92,51.81 37.05,51.94 42.13,51.94 43.02,51.05 52.16,51.05 | 52.16,51.05 57.87,51.05 59.4,49.53 v67.4,49.53 | v68.54,71.88 71.34,71.88 72.22,72.77 72.61,72.77 JP15.9 | v52.16,50.92 52.16,51.05
N$29  (via drill 0.25)
  Top 0.254: v71.08,64.26 68.92,62.1 68.92,60.83 68.72,60.62 IC2.19
  Bottom 0.254: v71.08,64.26 70.45,64.89 70.45,68.19 92.8,68.19 95.59,65.4 95.59,41.14 JP3.1
N$30  (via drill 0.25)
  Top 0.254: v68.03,56.38 68.03,59.05 67.92,59.16 IC2.20 | v83.53,55.24 85.94,52.83 v85.94,42.92
  Bottom 0.254: v68.03,56.38 69.18,55.24 v83.53,55.24 | v85.94,42.92 89.88,38.98 90,38.86 90.13,38.73 JP3.2
N$31  (via drill 0.25)
  Top 0.254: v71.21,65.4 67.27,61.46 67.27,60.83 67.12,60.68 IC2.21
  Bottom 0.254: v71.21,65.4 73.5,67.69 92.55,67.69 95.08,65.15 95.08,41.91 93.81,41.91 JP3.3
N$32  (via drill 0.25)
  Top 0.254: v66.51,63.5 66.51,60.83 66.38,60.7 66.38,59.81 66.34,59.77 IC2.22 | v83.53,63.5 88.23,58.8 88.23,44.06 90.39,41.91 90.64,41.65 JP3.4
  Bottom 0.254: v66.51,63.5 v83.53,63.5
N$33  (via drill 0.25)
  Top 0.254: v64.61,59.69 64.61,58.16 64.48,58.03 64.52,57.99 IC2.23 | v90.13,56.38 92.04,54.48 92.04,45.33 92.93,44.45 93.18,44.19 JP3.5
  Bottom 0.254: v64.61,59.69 86.83,59.69 v90.13,56.38
N$34  (via drill 0.25)
  Top 0.254: v65.62,44.57 65.62,49.14 66.64,50.16 66.64,57.02 65.24,57.02 65.09,57.17 IC2.24
  Bottom 0.254: v65.62,44.57 66.51,43.68 90,43.68 90.51,43.68 JP3.6
N$35
  Top 0.254: R2.S 89.37,58.41 89.37,53.72 90.39,52.7 90.39,49.53 90.64,49.27 JP3.10
N$36  (via drill 0.25)
  Top 0.254: IC2.31 65.48,51.57 v65.88,51.18
  Bottom 0.254: v65.88,51.18 73.37,51.18 74.51,52.32 89.24,52.32 93.31,56.38 93.31,65.27 91.91,66.67 R3.A
N$37
  Top 0.254: R4.1 85.18,69.21 88.73,69.21 R3.S
N$38  (via drill 0.25)
  Top 0.254: v59.02,46.22 56.86,46.22 56.6,46.22 56.22,46.6 56.18,46.65 Q1.E
  Bottom 0.254: v59.02,46.22 59.27,45.97 88.73,45.97 90.51,47.75 91.66,47.75 92.55,48.64 92.8,48.89 JP3.9
N$39  (via drill 0.25)
  Top 0.254: v59.02,48.13 56.86,48.13 56.73,48.13 56.22,48.64 56.18,48.59 Q1.B | v80.99,47.75 81.24,48 81.24,68.32 81.24,68.83 R4.2
  Bottom 0.254: v59.02,48.13 59.14,48 80.73,48 v80.99,47.75
N$40  (via drill 0.25)
  Top 0.254: v39.08,35.05 39.08,33.78 39.08,33.27 39.18,33.17 IC3.21 | v32.35,35.81 32.35,32.13 30.31,30.09 v30.31,11.81
  Bottom 0.254: v39.08,35.05 39.08,36.06 32.6,36.06 v32.35,35.81 | v30.31,11.81 27.39,8.89 27.39,8.5 27.27,8.38 JP7.4
N$41  (via drill 0.25)
  Top 0.254: v40.73,34.41 40.73,33.78 40.73,33.27 40.86,33.14 40.81,33.1 IC3.19 | v44.54,35.94 44.54,36.57 44.54,37.08 44.79,37.33 44.79,37.34 R5.2 | v52.03,35.3 52.03,9.01 51.91,8.89 JP4.1
  Bottom 0.254: v40.73,34.41 42.25,35.94 v44.54,35.94 44.67,35.81 44.79,35.81 51.52,35.81 v52.03,35.3
N$42  (via drill 0.25)
  Top 0.254: v38.19,34.41 38.19,33.78 38.32,33.65 38.32,33.14 38.36,33.1 IC3.22 | v30.82,34.41 29.55,33.14 29.55,8.89 29.55,8.38 JP7.6
  Bottom 0.254: v30.82,34.41 v38.19,34.41
N$43  (via drill 0.25)
  Top 0.254: v40.09,36.57 40.09,41.65 40.09,42.16 R7.1 | v30.82,36.57 28.03,33.78 28.03,24.12 27.58,23.68 | 27.58,23.68 27.01,23.11 26.76,22.86 TMP48.2 | v28.79,22.47 27.65,23.62 27.58,23.68 | v53.94,17.14 JP6.1
  Bottom 0.254: v30.82,36.57 v40.09,36.57 | v28.79,22.47 29.68,21.58 48.22,21.58 52.41,17.39 53.68,17.39 v53.94,17.14
N$44  (via drill 0.25)
  Top 0.254: v36.28,14.98 34.38,14.98 34.25,14.98 R6.1 | v28.79,16.5 28.79,19.55 27.01,21.33 26.76,21.58 TMP48.1
  Bottom 0.254: v28.79,16.5 30.19,15.11 36.03,15.11 36.16,15.11 v36.28,14.98 36.41,14.85 47.33,14.85 48.6,14.85 48.86,14.6 JP5.1
N$45
  Top 0.254: IC3.1 48.18,23.28 48.22,23.24 48.22,23.11 48.22,17.77 48.22,17.65 JP5.2
  Bottom 0.254: JP5.2 48.09,17.77 47.71,17.77 5.8,17.77 5.8,28.44 6.82,29.46 7.2,29.84 JP12.2
N$46  (via drill 0.25)
  Top 0.254: v46.19,17.01 46.19,20.31 46.32,20.44 46.38,20.5 IC3.44 | v53.68,14.6 JP6.2
  Bottom 0.254: v53.68,14.6 53.43,14.85 52.41,14.85 51.52,15.74 47.46,15.74 v46.19,17.01 45.94,17.27 5.3,17.27 5.3,29.97 7.07,31.74 7.71,32.38 JP12.3
N$47  (via drill 0.25)
  Top 0.254: v33.74,31.11 35.9,31.11 36.09,31.3 IC3.23 | v31.97,30.6 31.2,29.84 31.2,9.27 31.97,8.5 JP7.8
  Bottom 0.254: v33.74,31.11 33.24,30.6 v31.97,30.6
N$48  (via drill 0.25)
  Top 0.254: v37.94,29.71 37.94,29.97 37.55,30.35 37.3,30.35 37.17,30.47 36.54,30.47 36.56,30.5 IC3.24 | v31.97,28.06 31.84,27.93 31.84,11.55 34.51,8.89 34.76,8.63 JP7.10
  Bottom 0.254: v37.94,29.71 36.28,28.06 v31.97,28.06
N$49  (via drill 0.25)
  Top 0.254: v33.74,22.47 33.74,30.22 34.76,30.22 35.14,29.84 35.9,29.84 36.04,29.7 IC3.25 | v35.27,22.35 37.05,20.57 37.05,8.89 37.3,8.63 JP7.12
  Bottom 0.254: v35.27,22.35 34,22.35 33.87,22.35 v33.74,22.47
N$50  (via drill 0.25)
  Top 0.254: v41.49,23.24 41.62,23.36 41.62,30.47 40.09,32 40.09,32.38 40.09,32.89 39.97,33.02 39.98,33.03 IC3.20 | v23.71,21.58 23.96,21.33 23.96,8.89 24.35,8.5 JP7.2
  Bottom 0.254: v41.49,23.24 25.36,23.24 v23.71,21.58
N$51
  Top 0.254: IC3.31 36.65,24.9 36.66,24.89 37.17,24.89 37.3,24.76 37.68,24.76 37.68,10.79 39.59,8.89 39.84,8.63 JP7.14
N$52  (via drill 0.25)
  Top 0.254: v72.73,33.02 74,31.74 74,30.35 75.4,30.35 75.65,30.35 75.91,30.09 75.98,30.17 IC4.19 | v61.81,33.14 v61.81,36.7 | v59.02,38.73 52.92,44.83 52.92,69.72 53.56,70.35 53.56,71.37 53.81,71.62 JP8.1
  Bottom 0.254: v72.73,33.02 72.61,33.14 v61.81,33.14 | v61.81,36.7 59.78,38.73 v59.02,38.73
N$53  (via drill 0.25)
  Top 0.254: v74.26,32.51 74.51,32.25 74.51,31.11 75.4,31.11 75.78,31.11 75.91,30.98 75.92,30.97 IC4.20 | v61.3,32.38 61.18,32.25 v61.18,12.06
  Bottom 0.254: v74.26,32.51 74,32.25 67.91,32.25 67.65,32.51 62.19,32.51 62.06,32.38 v61.3,32.38 | v61.18,12.06 55.97,6.85 40.98,6.85 40.09,5.96 JP7.13
N$54  (via drill 0.25)
  Top 0.254: v75.02,33.27 75.02,31.87 75.4,31.87 75.91,31.87 76.03,31.74 76.06,31.77 IC4.21 | v59.02,32.51 58.38,31.87 58.38,10.54 52.41,4.57 38.32,4.57 37.68,5.2 37.55,5.33 37.3,5.58 JP7.11
  Bottom 0.254: v75.02,33.27 74.38,33.9 61.56,33.9 60.16,32.51 v59.02,32.51
N$55  (via drill 0.25)
  Top 0.254: v77.69,32.51 76.8,32.51 76.16,32.51 76.12,32.55 IC4.22
  Bottom 0.254: v77.69,32.51 86.45,32.51 90.51,28.44 93.56,28.44 94.32,27.68 94.32,18.54 65.37,18.54 56.98,10.16 43.27,10.16 39.97,6.85 36.28,6.85 35.27,5.84 35.01,5.84 34.89,5.71 JP7.9
N$56  (via drill 0.25)
  Top 0.254: v74.26,37.08 74.26,35.05 74.26,34.41 74.3,34.37 IC4.23 | v29.3,38.22 24.47,33.4 24.47,12.44 28.54,8.38 28.54,7.87 29.55,6.85 31.2,6.85 32.09,5.96 32.22,5.84 JP7.7
  Bottom 0.254: v74.26,37.08 71.84,39.49 36.28,39.49 35.01,38.22 v29.3,38.22
N$57  (via drill 0.25)
  Top 0.254: v73.5,36.44 73.5,35.05 73.5,34.41 73.52,34.39 IC4.24 | v59.02,35.94 57.62,34.54 v57.62,11.81
  Bottom 0.254: v73.5,36.44 73.37,36.57 66.26,36.57 65.62,35.94 v59.02,35.94 | v57.62,11.81 56.48,10.66 33.11,10.66 30.82,8.38 30.82,6.34 30.31,6.34 29.93,5.96 JP7.5
N$58  (via drill 0.25)
  Top 0.254: v67.65,24.51 67.65,26.54 68.16,27.05 68.16,32 68.03,32.13 68.03,33.65 67.91,33.78 67.91,34.29 67.92,34.3 IC4.31
  Bottom 0.254: v67.65,24.51 66.89,23.74 55.21,23.74 54.7,23.24 54.7,18.28 54.95,18.28 55.59,17.65 55.59,12.82 32.73,12.82 28.28,8.38 28.28,6.34 27.77,6.34 27.39,5.96 JP7.3
N$59  (via drill 0.25)
  Top 0.254: v26.76,33.52 v28.41,35.17 | v38.06,35.3 38.06,36.57 38.06,36.83 38.57,37.33 R8.2 | IC3.18 41.62,33.14 41.49,33.27 41.49,33.78 41.49,34.67 40.35,35.81 39.33,35.81 39.33,36.57 39.33,36.83 R8.2 | R8.2
  Bottom 0.254: v26.76,33.52 15.46,33.52 9.49,27.55 8.34,27.55 JP12.1 | v28.41,35.17 31.97,35.17 32.09,35.05 37.81,35.05 v38.06,35.3
N$60  (via drill 0.25)
  Top 0.254: v35.65,56 35.65,51.18 34.89,51.18 34.67,50.96 IC1.18 | v45.43,56.76 45.43,58.16 45.43,58.41 R9.1
  Bottom 0.254: v45.43,56.76 44.79,56.13 35.9,56.13 35.78,56.13 v35.65,56 35.39,56.26 17.11,56.26 15.96,56.26 JP9.1
N$61  (via drill 0.25)
  Top 0.254: v69.3,58.29 69.3,58.8 69.52,59.01 IC2.18 | JP10.1 57.75,58.92 57.75,58.41 57.75,53.59 R10.2
  Bottom 0.254: v69.3,58.29 69.18,58.41 58.64,58.41 58.25,58.41 JP10.1
N$62  (via drill 0.25)
  Top 0.254: v24.47,46.73 24.47,45.08 24.47,44.45 24.41,44.38 IC1.1 | v17.87,46.73 13.93,50.67 13.93,57.65 14.69,58.41 15.33,59.05 JP9.2
  Bottom 0.254: v17.87,46.73 v24.47,46.73
N$63
  Top 0.254: IC1.44 22.61,46.14 22.57,46.1 22.44,45.97 21.93,45.97 21.93,42.92 21.42,42.41 18.63,42.41 18.63,47.24 17.49,48.38 17.49,60.19 16.73,60.96 16.09,61.59 JP9.3
N$64  (via drill 0.25)
  Top 0.254: v71.97,57.91 71.97,53.34 74.51,50.8 74.51,50.16 75.4,50.16 75.59,49.97 IC2.1 | v63.59,59.69 62.19,61.08 v62.19,61.21
  Bottom 0.254: v71.97,57.91 70.83,59.05 64.99,59.05 64.86,58.92 64.35,58.92 v63.59,59.69 | v62.19,61.21 62.06,61.34 59.02,61.34 57.87,61.34 JP10.2
N$65  (via drill 0.25)
  Top 0.254: v74.13,49.53 74.13,48.89 74.26,48.76 74.26,48.26 74.38,48.13 74.34,48.17 IC2.44 | v59.02,50.92 59.14,51.05 59.14,58.29 59.4,58.54 59.4,62.73 58.64,63.5 58,64.13 JP10.3
  Bottom 0.254: v74.13,49.53 73.37,50.29 63.46,50.29 63.34,50.16 59.78,50.16 v59.02,50.92
N$66
  Top 0.254: JP11.1 77.94,8.38 77.94,11.17 77.94,11.81 | 77.94,11.81 R11.2 77.94,11.81 | IC4.18 76.16,29.33 76.29,29.2 76.8,29.2 78.45,29.2 78.45,16.5 79.21,15.74 79.21,13.08 78.83,12.7 77.94,11.81
N$67  (via drill 0.25)
  Top 0.254: v66.26,17.27 66.26,21.58 66.32,21.65 IC4.1
  Bottom 0.254: v66.26,17.27 74.77,8.76 79.08,8.76 79.84,8 80.48,7.36 JP11.2
N$68
  Top 0.254: IC4.44 64.8,24.57 64.86,24.51 64.86,16.63 77.18,4.31 83.02,4.31 83.02,5.96 JP11.3
N$69
  Top 0.254: JP13.1 8.09,39.62 8.34,39.37 10.63,37.08 10.63,21.97 10.63,17.14 8.98,15.49 8.98,4.31 11.01,2.28 30.31,2.28 31.33,3.3 33.36,5.33 33.36,6.85 39.97,6.85 41.36,8.25 41.36,20.82 41.58,21.04 IC3.38
N$70  (via drill 0.25)
  Top 0.254: v43.78,22.98 43.78,22.22 43.9,22.09 43.9,21.58 IC3.41
  Bottom 0.254: v43.78,22.98 42.25,24.51 23.84,24.51 22.82,25.52 7.58,25.52 6.31,26.79 6.31,28.19 6.82,28.7 7.2,28.7 9.23,28.7 9.87,29.33 9.87,38.86 7.07,38.86 6.18,39.75 5.93,40 JP13.2
N$71  (via drill 0.25)
  Top 0.254: v34.51,19.93 34.51,22.73 34.25,22.98 34.25,28.06 35.9,28.06 36.41,28.06 36.45,28.1 IC3.27 | v18.76,24.25 11.14,31.87 11.14,39.11 8.34,41.91 8.09,42.16 JP13.3
  Bottom 0.254: v34.51,19.93 23.08,19.93 v18.76,24.25
N$72  (via drill 0.25)
  Top 0.254: v34.51,29.46 34.51,29.08 35.9,29.08 36.03,29.08 36.16,28.95 36.21,28.9 IC3.26
  Bottom 0.254: v34.51,29.46 34.12,29.84 31.58,29.84 20.03,41.4 7.07,41.4 6.18,42.29 5.93,42.54 JP13.4
N$73  (via drill 0.25)
  Top 0.254: v49.37,18.41 49.37,24 48.86,24 48.35,24 48.22,24.12 48.2,24.1 IC3.2 | v9.87,22.22 9.87,36.7 6.95,39.62 6.95,43.56 7.84,44.45 8.09,44.7 JP13.5
  Bottom 0.254: v49.37,18.41 49.11,18.66 13.42,18.66 v9.87,22.22
N$74  (via drill 0.25)
  Top 0.254: v45.17,19.93 45.55,20.31 45.58,20.34 IC3.43 | v8.85,24.25 4.41,28.7 4.41,43.56 5.3,44.45 5.55,44.7 JP13.6
  Bottom 0.254: v45.17,19.93 44.41,19.17 13.93,19.17 v8.85,24.25
N$75  (via drill 0.25)
  Top 0.254: v50.25,23.49 50,23.74 50,25.65 48.86,25.65 48.35,25.65 48.22,25.65 IC3.4 | v23.33,24 22.57,24.76 22.57,32.76 8.34,46.98 8.09,47.24 JP13.7
  Bottom 0.254: v50.25,23.49 48.98,22.22 43.52,22.22 41.74,24 v23.33,24
N$76  (via drill 0.25)
  Top 0.254: v45.94,30.22 45.94,25.01 47.46,25.01 48.09,25.01 48.22,24.89 48.21,24.9 IC3.3 | v49.49,30.22 49.37,30.35 49.37,42.29 v48.48,43.18
  Bottom 0.254: v49.49,30.22 v45.94,30.22 | v48.48,43.18 47.71,43.94 10.76,43.94 8.22,46.48 7.07,46.48 6.18,47.37 5.93,47.62 JP13.8
N$77  (via drill 0.25)
  Top 0.254: v51.14,14.73 51.14,24.12 50.51,24.76 50.51,26.41 48.86,26.41 48.35,26.41 48.22,26.54 IC3.5
  Bottom 0.254: v51.14,14.73 49.87,13.46 5.93,13.46 3.64,15.74 3.64,53.84 5.93,53.84 6.69,53.08 6.69,50.8 6.06,50.16 JP13.10
N$78  (via drill 0.25)
  Top 0.254: v23.96,47.49 23.84,47.37 23.84,47.11 23.33,47.11 22.82,47.11 22.7,46.98 22.67,46.96 IC1.43 | v13.17,50.92 9.23,54.86 9.23,56.26 8.34,57.15 8.09,57.4 JP13.15
  Bottom 0.254: v13.17,50.92 20.54,50.92 v23.96,47.49
N$79  (via drill 0.25)
  Top 0.254: v25.49,52.57 25.49,50.67 25.23,50.41 25.23,45.08 25.23,44.45 25.21,44.42 IC1.2
  Bottom 0.254: v25.49,52.57 23.96,54.1 7.07,54.1 6.18,54.99 5.8,54.99 JP13.14
N$80  (via drill 0.25)
  Top 0.254: v26,46.73 26,45.08 26,44.45 26.01,44.43 IC1.3 | v10.88,52.07 8.34,54.61 8.34,55.11 8.22,55.24 JP13.13
  Bottom 0.254: v26,46.73 20.66,52.07 v10.88,52.07
N$81  (via drill 0.25)
  Top 0.254: v26.63,41.91 26.63,43.68 26.76,43.81 26.76,44.19 26.81,44.24 IC1.4
  Bottom 0.254: v26.63,41.91 26.38,42.16 10,42.16 8.22,43.94 5.17,43.94 4.15,44.95 4.15,52.45 4.92,52.45 5.3,52.45 JP13.12
N$82  (via drill 0.25)
  Top 0.254: v27.39,45.97 27.39,45.08 27.52,44.95 27.52,44.45 IC1.5
  Bottom 0.254: v27.39,45.97 15.2,45.97 8.73,52.45 8.34,52.45 JP13.11
N$83
  Top 0.254: JP13.16 5.55,58.16 5.3,58.41 4.41,59.3 4.41,62.73 16.85,62.73 18,61.59 18,48.64 21.93,48.64 22.57,48.64 22.61,48.59 IC1.41
N$84  (via drill 0.25)
  Top 0.254: v65.88,56.26 65.24,56.26 64.73,56.26 64.61,56.38 64.59,56.37 IC2.25 | v7.46,58.92 6.18,60.19 5.68,60.19 JP13.18
  Bottom 0.254: v65.88,56.26 65.49,55.88 45.94,55.88 45.3,55.24 12.15,55.24 8.47,58.92 v7.46,58.92
N$85  (via drill 0.25)
  Top 0.254: v61.43,63.5 61.43,55.75 63.46,55.75 63.64,55.57 IC2.26
  Bottom 0.254: v61.43,63.5 59.4,65.53 48.98,65.53 48.48,65.02 13.17,65.02 8.73,60.57 8.34,60.57 JP13.17
N$86  (via drill 0.25)
  Top 0.254: v61.05,34.41 61.05,36.95 61.18,37.08 61.18,54.99 63.46,54.99 63.68,54.77 IC2.27
  Bottom 0.254: v61.05,34.41 77.3,34.41 77.43,34.54 85.18,34.54 86.19,33.52 91.66,33.52 92.55,32.63 92.8,32.38 JP14.2
N$87  (via drill 0.25)
  Top 0.254: v71.97,41.65 71.97,47.49 71.92,47.54 IC2.41 | v86.07,36.57 90,32.63 90.39,32.63 JP14.1
  Bottom 0.254: v71.97,41.65 77.05,36.57 v86.07,36.57
N$88  (via drill 0.25)
  Top 0.254: v69.43,35.81 69.43,47.49 69.52,47.58 IC2.38
  Bottom 0.254: v69.43,35.81 70.19,35.05 85.43,35.05 86.45,34.03 93.05,34.03 94.32,32.76 94.32,31.36 93.18,30.22 JP14.4
N$89  (via drill 0.25)
  Top 0.254: v77.69,33.78 77.69,35.81 73.62,39.87 73.62,47.49 73.52,47.6 IC2.43
  Bottom 0.254: v77.69,33.78 78.45,33.02 87.08,33.02 90,30.09 90.26,29.84 JP14.3
N$90  (via drill 0.25)
  Top 0.254: v77.69,50.67 76.8,50.67 76.69,50.77 IC2.2 | v86.7,49.27 87.72,48.26 87.72,39.75 92.04,35.43 92.04,28.82 92.93,27.93 92.93,27.55 JP14.6
  Bottom 0.254: v77.69,50.67 79.08,49.27 v86.7,49.27
N$91  (via drill 0.25)
  Top 0.254: v77.69,51.56 76.92,51.56 | 76.92,51.56 76.8,51.56 | v94.32,42.67 94.32,26.92 93.56,26.16 92.55,26.16 91.4,27.3 JP14.5 | IC2.3 76.91,51.57 76.92,51.56
  Bottom 0.254: v77.69,51.56 77.81,51.43 92.16,51.43 94.32,49.27 v94.32,42.67
N$92  (via drill 0.25)
  Top 0.254: v79.46,28.95 78.45,29.97 78.45,52.95 76.8,52.95 76.58,53.17 IC2.5
  Bottom 0.254: v79.46,28.95 83.4,25.01 90,25.01 90.39,25.01 JP14.7
N$93  (via drill 0.25)
  Top 0.254: v74.77,51.56 74.77,52.32 75.53,52.32 75.58,52.37 IC2.4 | v82.64,48.51 85.05,46.1 v85.05,31.36
  Bottom 0.254: v74.77,51.56 77.81,48.51 v82.64,48.51 | v85.05,31.36 90.51,25.9 91.66,25.9 92.55,25.01 92.8,24.76 JP14.8
N$94  (via drill 0.25)
  Top 0.254: v72.73,35.81 72.73,35.05 72.73,34.41 72.72,34.4 IC4.25 | v85.81,35.68 88.23,33.27 88.23,28.19 90.51,25.9 92.04,25.9 92.04,23.74 92.93,22.86 92.93,22.6 93.18,22.35 JP14.10
  Bottom 0.254: v72.73,35.81 72.86,35.68 v85.81,35.68
N$95  (via drill 0.25)
  Top 0.254: v73.24,30.47 71.97,31.74 71.97,33.65 71.92,33.7 IC4.26 | v88.1,25.78 90.39,23.49 90.39,22.86 90.39,22.47 JP14.9
  Bottom 0.254: v73.24,30.47 74,29.71 82.13,29.71 86.07,25.78 v88.1,25.78
N$96  (via drill 0.25)
  Top 0.254: v85.56,27.3 88.99,23.87 88.99,22.35 90.51,20.82 92.93,20.82 92.93,20.31 92.93,19.81 93.05,19.68 JP14.12 | IC4.27 71.12,33.36 71.34,33.14 v71.34,30.98
  Bottom 0.254: v71.34,30.98 71.59,31.24 81.62,31.24 v85.56,27.3
N$97  (via drill 0.25)
  Top 0.254: v62.19,22.22 62.19,26.79 63.84,26.79 64.35,26.79 64.48,26.92 IC4.41
  Bottom 0.254: v62.19,22.22 64.48,19.93 90,19.93 90.39,19.93 JP14.11
N$98  (via drill 0.25)
  Top 0.254: v67.4,31.74 67.14,31.49 67.14,25.52 65.24,25.52 64.73,25.52 64.61,25.39 64.58,25.37 IC4.43 | v83.15,31.74 84.54,30.35 84.54,24.25 90.51,18.28 92.93,18.28 92.93,17.77 92.93,17.39 JP14.14
  Bottom 0.254: v67.4,31.74 v83.15,31.74
N$99  (via drill 0.25)
  Top 0.254: v67.02,17.77 67.02,21.71 67.12,21.81 IC4.2
  Bottom 0.254: v67.02,17.77 67.27,17.77 89.88,17.77 90,17.77 JP14.13
N$100  (via drill 0.25)
  Top 0.254: v67.78,17.01 67.78,21.71 67.92,21.85 IC4.3
  Bottom 0.254: v67.78,17.01 71.59,13.2 91.66,13.2 92.55,12.31 92.8,12.06 JP14.18
N$101
  Top 0.254: IC4.4 68.72,21.89 68.54,21.71 68.54,13.71 77.43,4.82 81.88,4.82 81.88,8.12 85.56,11.81 90,11.81 90.39,11.81 JP14.17
N$102  (via drill 0.25)
  Top 0.254: v76.16,15.36 69.69,21.84 69.52,22 IC4.5
  Bottom 0.254: v76.16,15.36 76.67,14.85 90,14.85 90.39,14.85 JP14.15
N$103  (via drill 0.25)
  Top 0.254: v62.57,46.73 62.57,32.89 62.45,32.76 62.45,29.59 63.84,29.59 64.06,29.37 IC4.38
  Bottom 0.254: v62.57,46.73 62.32,46.98 44.16,46.98 41.62,44.45 14.19,44.45 8.73,49.91 8.47,50.16 JP13.9
N$104  (via drill 0.25)
  Top 0.254: v26.12,58.16 26.12,56.64 26.01,56.52 IC1.31 | v92.55,62.73 95.08,60.19 95.08,16.89 93.43,15.24 93.18,14.98 JP14.16
  Bottom 0.254: v26.12,58.16 29.93,61.97 55.71,61.97 56.48,62.73 v92.55,62.73
VCC  (via drill 0.25)
  Top 0: R6.2 32.85,19.17 32.85,19.3
  Top 0.254: 28.41,57.02 28.41,57.15
  Top 0.508: IC4.40 63.88,27.77 63.84,27.81 | IC2.40 71.12,47.15 71.08,47.11 | IC2.17 70.32,59.81 70.32,60.83 | IC1.40 21.34,49.36 21.3,49.4 | IC1.7 29.21,43.34 29.17,43.3 | IC3.7 49.2,28.1 49.24,28.06 | IC3.40 43.18,19.97 43.14,19.93 | 42.38,32.13 42.38,32.51 IC3.17 | 71.12,21.67 71.08,21.71 71.12,21.75 IC4.7 | IC1.28 28.41,57.02 v28.16,57.27 | 70.32,35.55 70.32,34.41 | 70.32,34.41 IC4.28 | v77.43,54.48 77.43,54.73 77.39,54.77 IC2.7 | 63.21,53.97 IC2.28 | 77.43,28.57 IC4.17 | 70.32,34.41 70.32,32.89 | 36.66,50.16 IC1.17
  Top 0.61: 73.18,19.62 77.05,15.74 78.07,14.73 78.06,14.73 R11.1 | 73.18,19.62 71.21,21.58 71.12,21.67 | 77.43,28.57 v77.43,27.05 77.43,23.87 73.37,19.81 73.18,19.62 | v35.01,27.3 35.9,27.3 IC3.28 | v42.38,28.44 42.38,32.13 | v61.94,27.81 63.84,27.81 | v49.49,27.81 49.24,28.06 | v22.7,21.33 21.81,21.33 20.92,21.33 20.66,21.58 | v42.13,19.93 43.14,19.93 43.14,10.03 46.19,6.98 50,6.98 JP4.2 | 77.94,61.59 77.94,69.34 75.53,71.75 75.53,72.77 75.53,72.89 JP15.11 | 77.94,61.59 77.94,54.73 77.43,54.73 v77.43,54.48 | 70.32,44.45 70.32,46.35 71.08,47.11 | 70.32,44.45 70.32,35.55 | v70.32,61.21 70.32,60.83 | v71.21,44.45 70.57,44.45 70.32,44.45 | 77.94,61.59 v78.07,61.59 | v29.17,41.91 29.17,43.3 | v34.63,38.98 35.14,38.48 35.14,38.35 35.9,37.59 35.9,37.58 R8.1 36.03,37.59 36.66,38.22 36.66,38.35 36.66,49.91 36.66,50.16 | v21.3,57.02 21.3,49.4 | v28.16,57.27 28.41,57.02 | 36.66,50.16 41.74,50.16 41.74,43.43 41.74,43.3 R7.2 | 36.66,50.16 36.54,50.16 36.54,50.41 36.54,56.38 v36.03,56.89 | 63.21,53.97 61.94,53.97 v61.94,54.22 | 55.78,53.65 55.71,53.59 54.83,52.7 R10.1 54.57,52.32 54.57,51.81 54.57,48.26 54.32,48 53.94,47.62 Q1.C | v56.35,54.22 55.78,53.65 | v50.63,54.35 50.63,57.15 49.62,58.16 48.86,58.92 | 55.78,53.65 55.59,53.84 55.59,69.84 56.1,70.35 56.35,70.61 JP8.2 | v47.59,57.65 48.09,58.16 48.86,58.92 | v33.11,38.98 33.24,38.86 33.24,32 32.85,31.62 32.85,27.43 32.85,27.3 v32.98,27.17 32.98,22.98 32.85,22.86 32.85,21.08 v33.11,20.82 32.85,20.57 32.85,19.3 | 20.66,21.58 TMP48.8 20.66,21.58 | 20.66,21.58 19.9,21.58 19.65,21.33 13.17,14.85 13.17,7.11 J1.1 | 48.86,58.92 48.86,58.93 | 48.86,58.93 R9.2 48.86,58.93
  Top 0.61: 48.86,58.92 48.86,58.93 | JP3.7 93.18,46.73 93.43,46.98 94.45,48 94.45,58.67 92.16,60.96 92.16,61.34 91.91,61.59 R2.E | 70.32,32.89 70.32,29.84 70.7,29.46 70.7,28.82 71.21,28.32 v71.21,27.05
  Bottom 0.61: QG1.4 62.7,5.71 52.67,5.71 JP4.2 | v32.98,27.17 34.89,27.17 v35.01,27.3 35.27,27.3 41.24,27.3 41.94,28 | 41.94,28 v42.38,28.44 | v61.94,27.81 v49.49,27.81 42.13,27.81 41.94,28 | v77.43,27.05 v71.21,27.05 69.43,27.05 68.8,27.68 62.19,27.68 | v22.7,21.33 23.33,20.7 32.6,20.7 32.73,20.82 v33.11,20.82 | v42.13,19.93 41.24,20.82 33.49,20.82 | 33.49,20.82 33.36,20.82 v33.11,20.82 | JP15.13 77.3,73.02 76.03,73.02 JP15.11 | v70.32,61.21 70.45,61.34 78.07,61.34 | 78.07,61.34 91.28,61.34 91.66,61.34 91.91,61.59 R2.E | v71.21,44.45 71.34,44.32 89.37,44.32 90.13,45.08 91.53,45.08 92.55,46.1 92.8,46.35 JP3.7 | v78.07,61.59 78.07,61.34 | v29.17,41.91 32.09,38.98 v33.11,38.98 v34.63,38.98 | v21.3,57.02 21.55,57.27 v28.16,57.27 28.28,57.15 28.41,57.15 28.66,56.89 v36.03,56.89 36.16,57.02 36.28,57.02 36.92,57.65 v47.59,57.65 | v77.43,54.48 68.67,54.48 68.41,54.22 62.19,54.22 v61.94,54.22 v56.35,54.22 56.22,54.35 v50.63,54.35 | v33.11,20.82 33.49,20.82